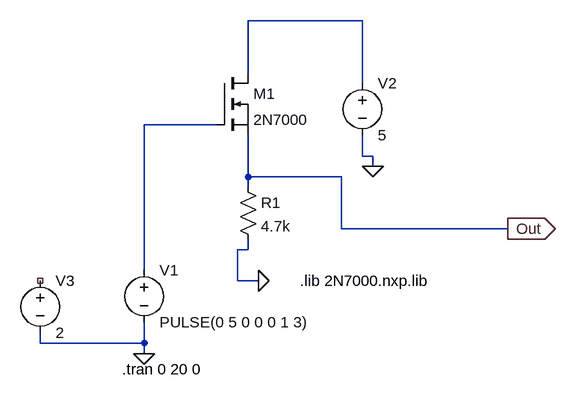
[diagram p0: schematic MOSFET.asc]
MOSFET.asc, the LTspice schematic file:
Version 4
SHEET 1 880 680
WIRE 320 -160 144 -160
WIRE 144 -80 144 -160
WIRE 320 -64 320 -160
WIRE 96 0 -16 0
WIRE 320 48 320 16
WIRE 336 48 320 48
WIRE 336 64 336 48
WIRE 144 80 144 16
WIRE 288 80 144 80
WIRE 144 96 144 80
WIRE 288 160 288 80
WIRE 544 160 288 160
WIRE 144 192 144 176
WIRE 144 192 128 192
WIRE -16 224 -16 0
WIRE 128 240 128 192
WIRE 160 240 128 240
WIRE -176 336 -176 320
WIRE -16 336 -16 304
WIRE -16 336 -176 336
WIRE -16 352 -16 336
FLAG -16 352 0
FLAG 160 240 0
FLAG 336 64 0
FLAG 544 160 Out
IOPIN 544 160 Out
SYMBOL nmos 96 -80 R0
SYMATTR InstName M1
SYMATTR Value 2N7000
SYMATTR Prefix X
SYMBOL voltage -16 208 R0
WINDOW 123 0 0 Left 0
WINDOW 39 0 0 Left 0
SYMATTR InstName V1
SYMATTR Value PULSE(0 5 0 0 0 1 3)
SYMBOL voltage 320 -80 R0
WINDOW 123 0 0 Left 0
WINDOW 39 0 0 Left 0
SYMATTR InstName V2
SYMATTR Value 5
SYMBOL res 128 80 R0
SYMATTR InstName R1
SYMATTR Value 4.7k
SYMBOL voltage -176 224 R0
WINDOW 123 0 0 Left 0
WINDOW 39 0 0 Left 0
SYMATTR InstName V3
SYMATTR Value 2
TEXT 224 240 Left 2 !.lib 2N7000.nxp.lib
TEXT -50 376 Left 2 !.tran 0 20 0

The netlist it stands for:
* MOSFET.asc
XM1 N001 N002 Out 2N7000  ; pins D G S
V1 N002 0 PULSE(0 5 0 0 0 1 3)
V2 N001 0 5
R1 Out 0 4.7k
V3 NC_01 0 2
.lib 2N7000.nxp.lib
.tran 0 20 0
.backanno
.end